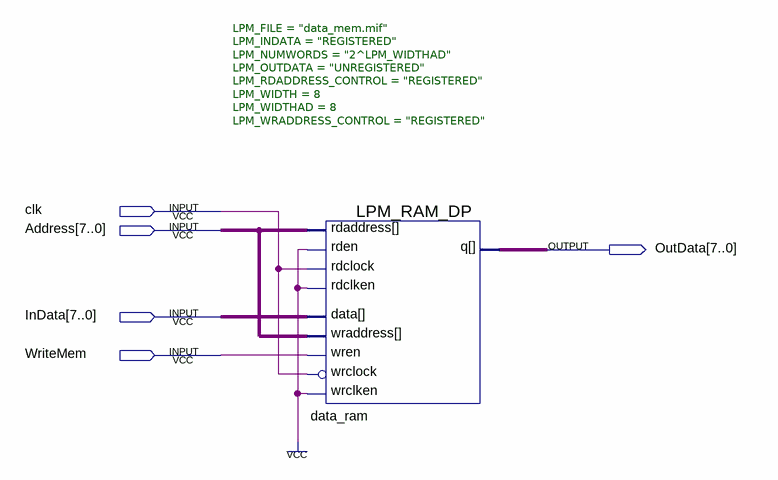
[diagram p0: schematic sheet]
// Quartus schematic data_ram.bdf as structural Verilog: 1 symbols, 5 pins
module data_ram (
  input  clk,
  input  [7:0] Address,
  input  [7:0] InData,
  input  WriteMem,
  output [7:0] OutData
);

  LPM_RAM_DP #(.LPM_FILE("data_mem.mif"), .LPM_INDATA("REGISTERED"), .LPM_NUMWORDS("2^LPM_WIDTHAD"), .LPM_OUTDATA("UNREGISTERED"), .LPM_RDADDRESS_CONTROL("REGISTERED"), .LPM_WIDTH(8), .LPM_WIDTHAD(8), .LPM_WRADDRESS_CONTROL("REGISTERED")) data_ram (
    .data(InData), .rdaddress(Address), .rdclken(1'b1), .rdclock(clk), .rden(1'b1), .wraddress(Address),
    .wrclken(1'b1), .wrclock(~clk), .wren(WriteMem), .q(OutData));
endmodule
